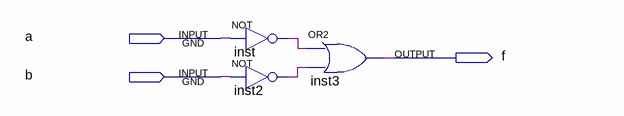
[diagram p0: schematic sheet]
// Quartus schematic 2-2-1-after.bdf as structural Verilog: 3 symbols, 3 pins
module \2-2-1-after  (
  input  a,
  input  b,
  output f
);

  wire inst2_out, inst_out;

  not inst (inst_out, a);
  not inst2 (inst2_out, b);
  or inst3 (f, inst_out, inst2_out);
endmodule
